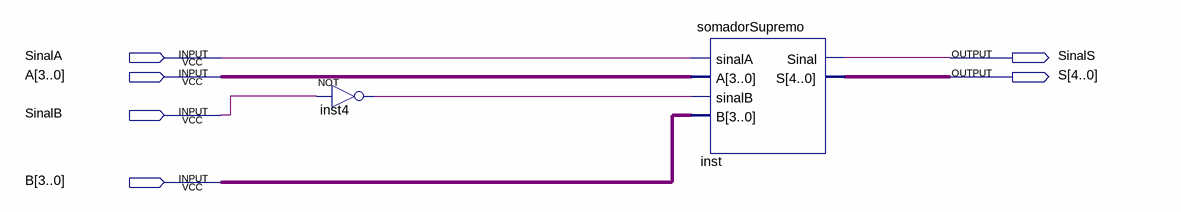
[diagram p0: schematic sheet]
// Quartus schematic subtrator.bdf as structural Verilog: 2 symbols, 6 pins
module subtrator (
  input  SinalA,
  input  [3:0] A,
  input  SinalB,
  input  [3:0] B,
  output SinalS,
  output [4:0] S
);

  wire inst4_out;

  not inst4 (inst4_out, SinalB);
  somadorSupremo inst (.sinalA(SinalA), .A(A), .sinalB(inst4_out), .B(B), .Sinal(SinalS), .S(S));
endmodule
